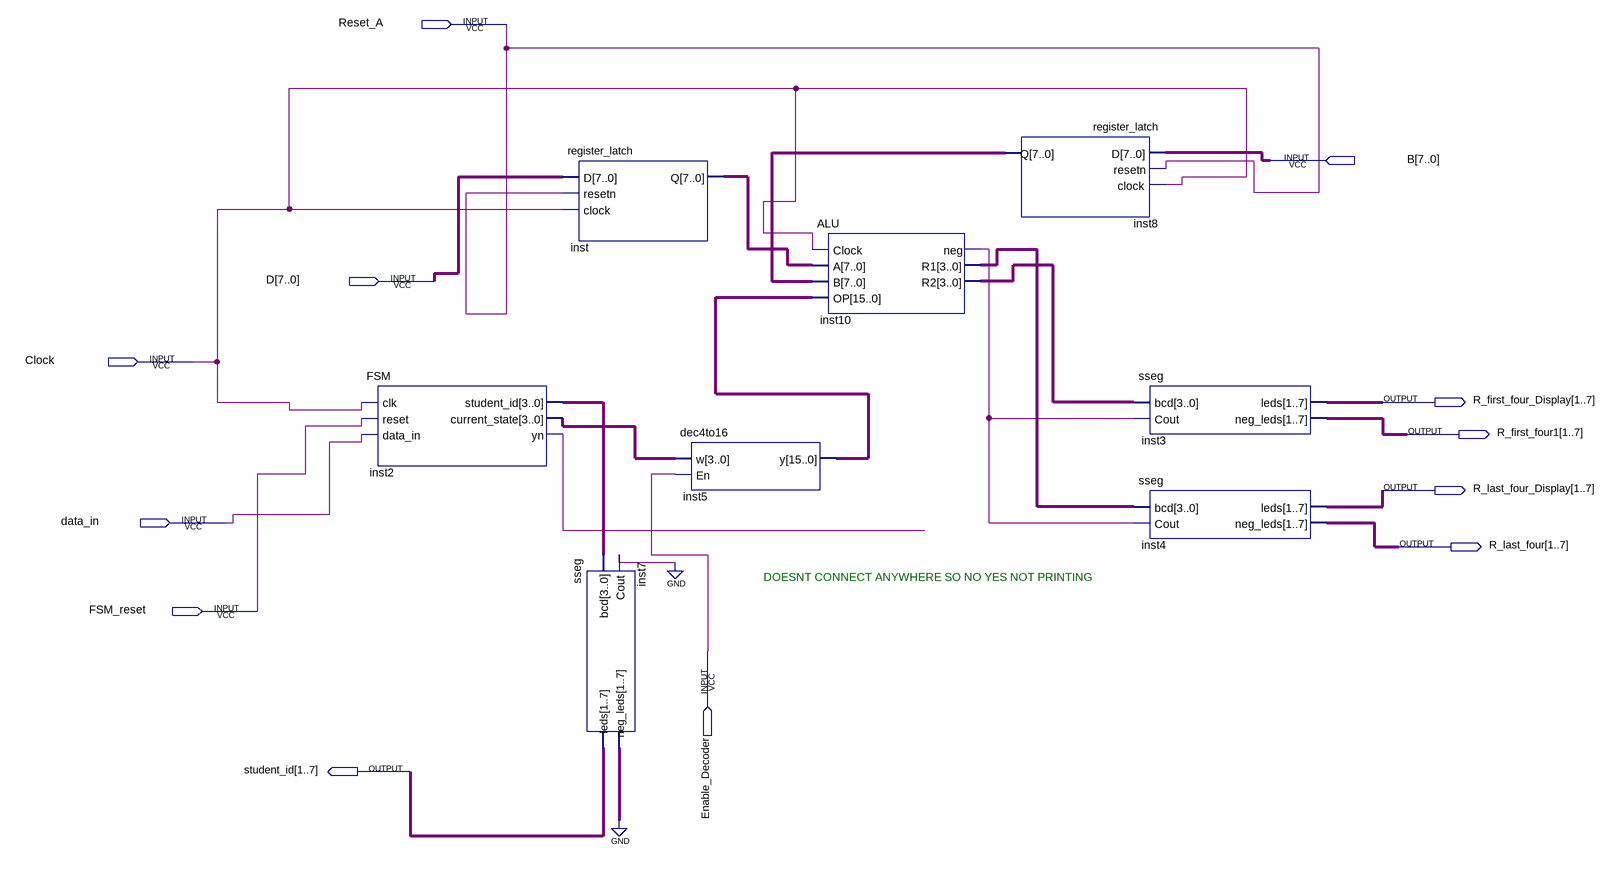
[diagram p0: schematic sheet]
// Quartus schematic finalblock.bdf as structural Verilog: 8 symbols, 12 pins
module finalblock (
  input  Reset_A,
  input  [7:0] B,
  input  [7:0] D,
  input  Clock,
  input  data_in,
  input  FSM_reset,
  input  Enable_Decoder,
  output [1:7] R_first_four_Display,
  output [1:7] R_first_four1,
  output [1:7] R_last_four_Display,
  output [1:7] R_last_four,
  output [1:7] student_id
);

  wire inst2_yn, inst10_neg;
  wire [3:0] inst2_current_state, inst2_student_id, inst10_r1, inst10_r2;
  wire [6:0] inst7_neg_leds;
  wire [7:0] inst8_q, inst_q;
  wire [15:0] inst5_y;

  FSM inst2 (
    .clk(Clock), .reset(FSM_reset), .data_in(data_in), .student_id(inst2_student_id),
    .current_state(inst2_current_state), .yn(inst2_yn));
  register_latch inst (.D(D), .resetn(Reset_A), .clock(Clock), .Q(inst_q));
  sseg inst7 (.bcd(inst2_student_id), .Cout(1'b0), .leds(student_id), .neg_leds(inst7_neg_leds));
  dec4to16 inst5 (.w(inst2_current_state), .En(Enable_Decoder), .y(inst5_y));
  ALU inst10 (.Clock(Clock), .A(inst_q), .B(inst8_q), .OP(inst5_y), .neg(inst10_neg), .R1(inst10_r1), .R2(inst10_r2));
  register_latch inst8 (.D(B), .resetn(Reset_A), .clock(Clock), .Q(inst8_q));
  sseg inst3 (.bcd(inst10_r2), .Cout(inst10_neg), .leds(R_first_four_Display), .neg_leds(R_first_four1));
  sseg inst4 (.bcd(inst10_r1), .Cout(inst10_neg), .leds(R_last_four_Display), .neg_leds(R_last_four));
  // also tied to GND on the sheet: {inst7_neg_leds[0], inst7_neg_leds[1], inst7_neg_leds[2], inst7_neg_leds[3], inst7_neg_leds[4], inst7_neg_leds[5], inst7_neg_leds[6]}

  // Notes on the sheet:
  //   DOESNT CONNECT ANYWHERE SO NO YES NOT PRINTING
endmodule
